# EAGLE design iomk4 (EAGLE 6.5.0)
Lås larm IO-Kort
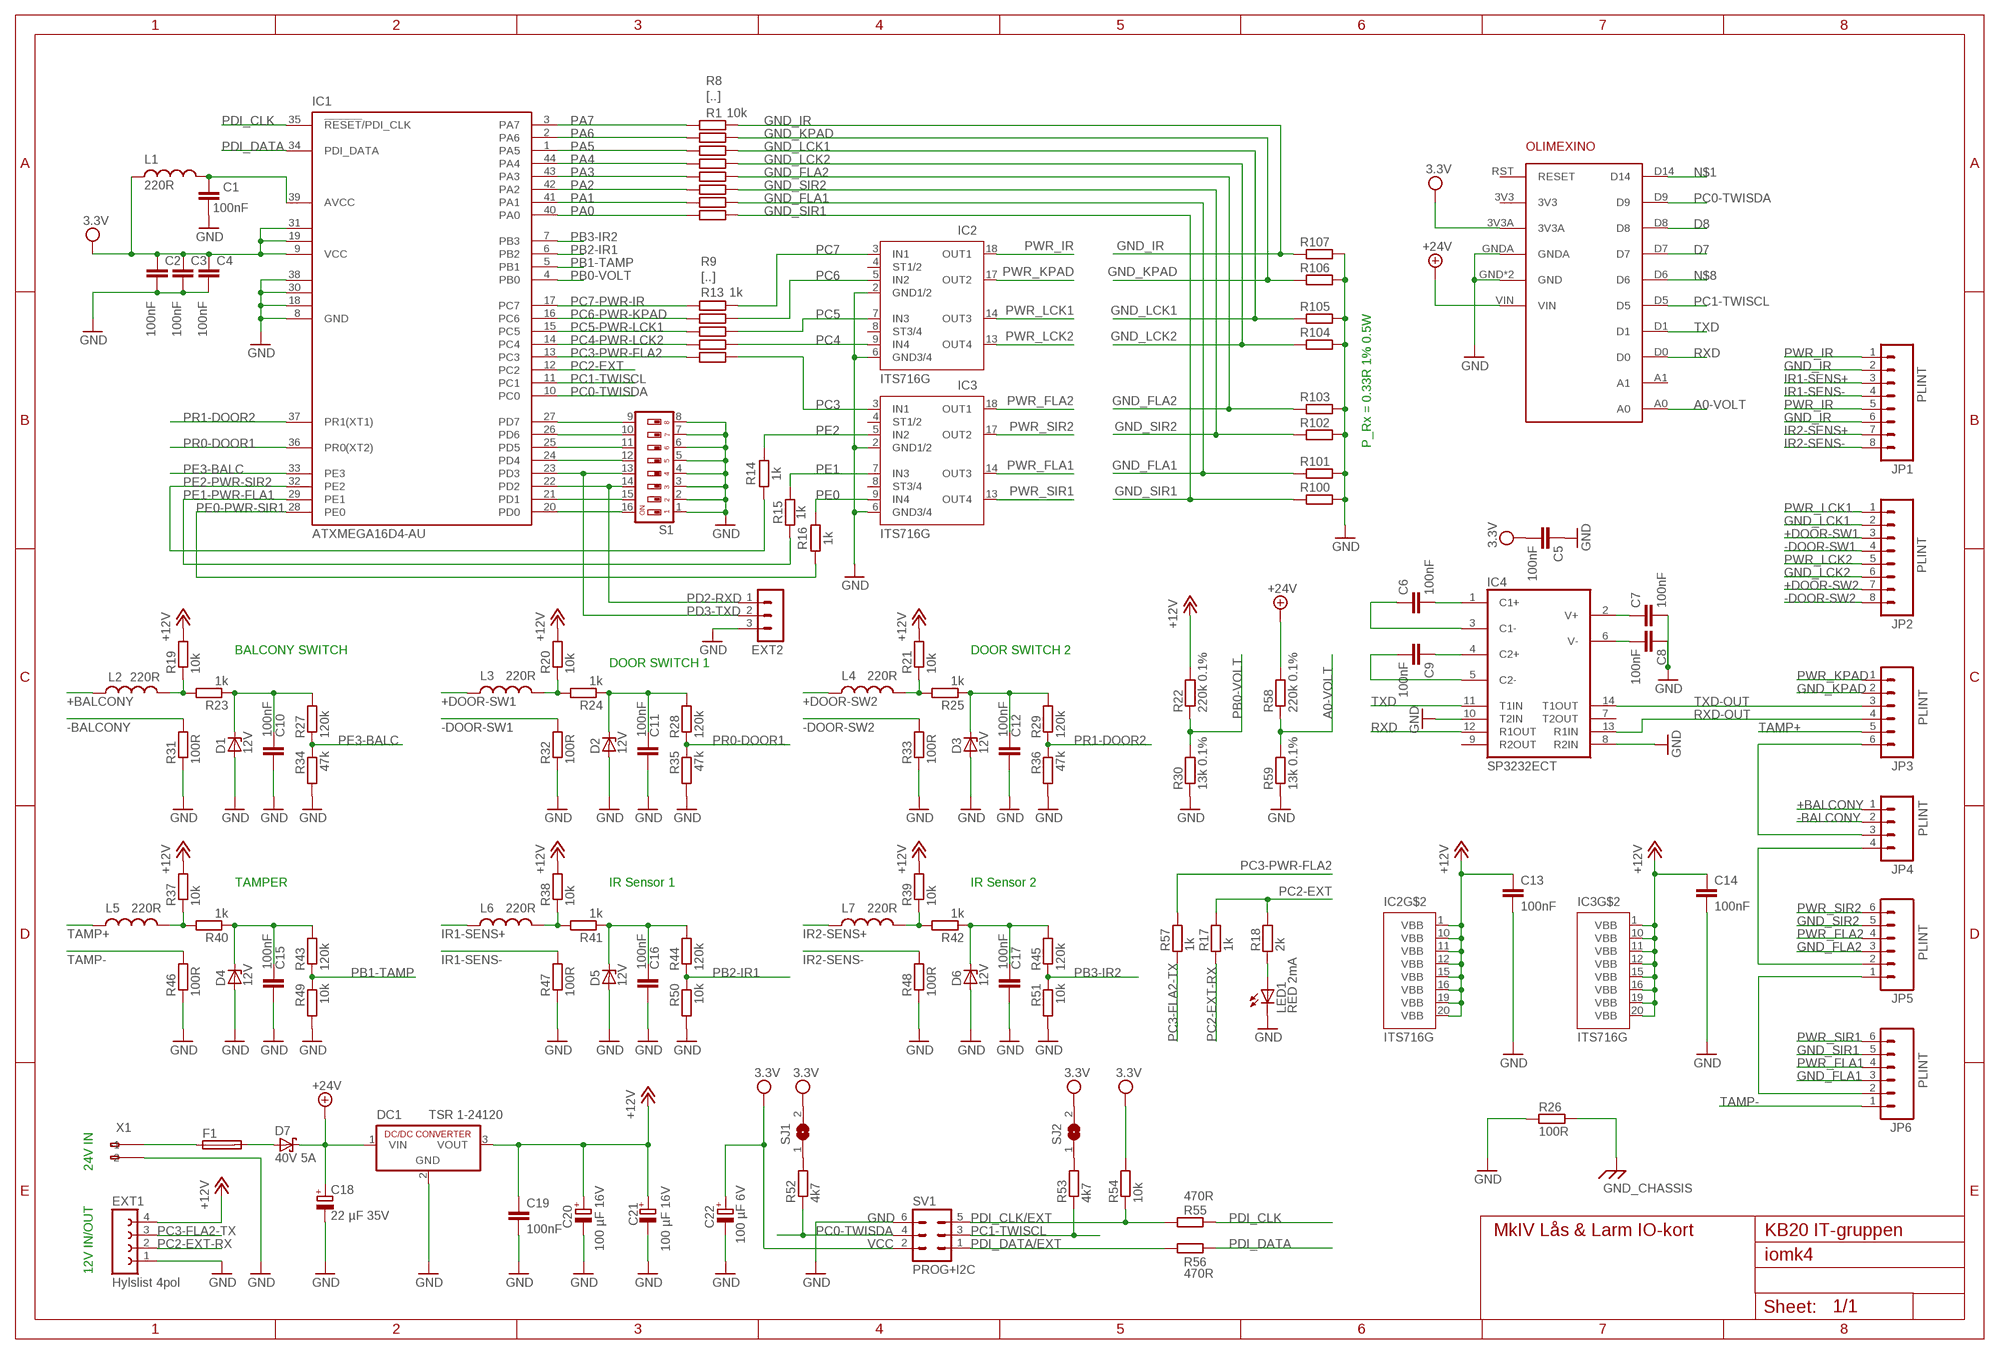
[diagram p0: schematic, sheet 1]

## Parts
C1  100nF  CAPACITOR  [C0805]
C2  100nF  CAPACITOR  [C0805]
C3  100nF  CAPACITOR  [C0805]
C4  100nF  CAPACITOR  [C0805]
C5  100nF  CAPACITOR  [C0805]
C6  100nF  CAPACITOR  [C0805]
C7  100nF  CAPACITOR  [C0805]
C8  100nF  CAPACITOR  [C0805]
C9  100nF  CAPACITOR  [C0805]
C10  100nF  CAPACITOR  [C0805]
C11  100nF  CAPACITOR  [C0805]
C12  100nF  CAPACITOR  [C0805]
C13  100nF  CAPACITOR  [C0805]
C14  100nF  CAPACITOR  [C0805]
C15  100nF  CAPACITOR  [C0805]
C16  100nF  CAPACITOR  [C0805]
C17  100nF  CAPACITOR  [C0805]
C18  22 µF 35V  CPOL-EUD/7343-31R  [D/7343-31R]
C19  100nF  CAPACITOR  [C0805]
C20  100 µF 16V  CPOL-EUD/7343-31R  [D/7343-31R]
C21  100 µF 16V  CPOL-EUD/7343-31R  [D/7343-31R]
C22  100 µF 6V  CPOL-EUCT6032  [CT6032]
D1  12V  ZENER-DIODESOD80C  [SOD80C]
D2  12V  ZENER-DIODESOD80C  [SOD80C]
D3  12V  ZENER-DIODESOD80C  [SOD80C]
D4  12V  ZENER-DIODESOD80C  [SOD80C]
D5  12V  ZENER-DIODESOD80C  [SOD80C]
D6  12V  ZENER-DIODESOD80C  [SOD80C]
D7  40V 5A  SCHOTTKY-DIODESMD  [SMB]
DC1  TSR 1-24120  R-78C12-1.0  [SIP3]
EXT1  Hylslist 4pol  FE04  [FE04]
EXT2  DEBUG PINS  MA03-1-  [MA03]
F1  Fuse Holder  FUSEFTP/60  [FTP/60]
IC1  ATXMEGA16D4-AU  XMEGA16A4A  [TQFP44]
IC2  ITS716G  BTS716G  [PG-DSO-20]
IC3  ITS716G  BTS716G  [PG-DSO-20]
IC4  SP3232ECT  MAX3232CWE  [SO16L]
JP1  PLINT  FK-MPT-8-3.5  [FK-MPT-8-3,5]
JP2  PLINT  FK-MPT-8-3.5  [FK-MPT-8-3,5]
JP3  PLINT  FK-MPT-6-3.5  [FK-MPT-6-3,5]
JP4  PLINT  FK-MPT-4-3.5  [FK-MPT-4-3.5]
JP5  PLINT  FK-MPT-6-3.5  [FK-MPT-6-3,5]
JP6  PLINT  FK-MPT-6-3.5  [FK-MPT-6-3,5]
L1  220R  FERRITE-BEADSL  [L0805]
L2  220R  FERRITE-BEADSL  [L0805]
L3  220R  FERRITE-BEADSL  [L0805]
L4  220R  FERRITE-BEADSL  [L0805]
L5  220R  FERRITE-BEADSL  [L0805]
L6  220R  FERRITE-BEADSL  [L0805]
L7  220R  FERRITE-BEADSL  [L0805]
LED1  RED 2mA  LEDSML0603  [SML0603]
OLIMEXINO-STM1  OLIMEXINO  [OLIMEXINO-STM32]
R1  10k  RESISTORR0805  [R0805]
R2  10k  RESISTORR0805  [R0805]
R3  10k  RESISTORR0805  [R0805]
R4  10k  RESISTORR0805  [R0805]
R5  10k  RESISTORR0805  [R0805]
R6  10k  RESISTORR0805  [R0805]
R7  10k  RESISTORR0805  [R0805]
R8  10k  RESISTORR0805  [R0805]
R9  1k  RESISTORR0805  [R0805]
R10  1k  RESISTORR0805  [R0805]
R11  1k  RESISTORR0805  [R0805]
R12  1k  RESISTORR0805  [R0805]
R13  1k  RESISTORR0805  [R0805]
R14  1k  RESISTORR0805  [R0805]
R15  1k  RESISTORR0805  [R0805]
R16  1k  RESISTORR0805  [R0805]
R17  1k  RESISTORR0805  [R0805]
R18  2k  RESISTORR0805  [R0805]
R19  10k  RESISTORR0805  [R0805]
R20  10k  RESISTORR0805  [R0805]
R21  10k  RESISTORR0805  [R0805]
R22  220k 0.1%  RESISTORR0805  [R0805]
R23  1k  RESISTORR0805  [R0805]
R24  1k  RESISTORR0805  [R0805]
R25  1k  RESISTORR0805  [R0805]
R26  100R  RESISTORR0805  [R0805]
R27  120k  RESISTORR0805  [R0805]
R28  120k  RESISTORR0805  [R0805]
R29  120k  RESISTORR0805  [R0805]
R30  13k 0.1%  RESISTORR0805  [R0805]
R31  100R  RESISTORR0805  [R0805]
R32  100R  RESISTORR0805  [R0805]
R33  100R  RESISTORR0805  [R0805]
R34  47k  RESISTORR0805  [R0805]
R35  47k  RESISTORR0805  [R0805]
R36  47k  RESISTORR0805  [R0805]
R37  10k  RESISTORR0805  [R0805]
R38  10k  RESISTORR0805  [R0805]
R39  10k  RESISTORR0805  [R0805]
R40  1k  RESISTORR0805  [R0805]
R41  1k  RESISTORR0805  [R0805]
R42  1k  RESISTORR0805  [R0805]
R43  120k  RESISTORR0805  [R0805]
R44  120k  RESISTORR0805  [R0805]
R45  120k  RESISTORR0805  [R0805]
R46  100R  RESISTORR0805  [R0805]
R47  100R  RESISTORR0805  [R0805]
R48  100R  RESISTORR0805  [R0805]
R49  10k  RESISTORR0805  [R0805]
R50  10k  RESISTORR0805  [R0805]
R51  10k  RESISTORR0805  [R0805]
R52  4k7  RESISTORR0805  [R0805]
R53  4k7  RESISTORR0805  [R0805]
R54  10k  RESISTORR0805  [R0805]
R55  470R  RESISTORR0805  [R0805]
R56  470R  RESISTORR0805  [R0805]
R57  1k  RESISTORR0805  [R0805]
R58  220k 0.1%  RESISTORR0805  [R0805]
R59  13k 0.1%  RESISTORR0805  [R0805]
R100  0.33R  RESISTORR1210  [R1210]
R101  0.33R  RESISTORR1210  [R1210]
R102  0.33R  RESISTORR1210  [R1210]
R103  0.33R  RESISTORR1210  [R1210]
R104  0.33R  RESISTORR1210  [R1210]
R105  0.33R  RESISTORR1210  [R1210]
R106  0.33R  RESISTORR1210  [R1210]
R107  0.33R  RESISTORR1210  [R1210]
S1  DIP switches  SWS008  [DIL08-SMD-MINI]
SJ1  Solder jumper  SJ  [SJ]
SJ2  Solder jumper  SJ  [SJ]
SV1  PROG+I2C  ML6L  [ML6L]
X1  PLINT  255-402-5  [255-402-5]

## Nets
+12V [12V]: C13.1 C14.1 C19.1 C20.+ C21.+ DC1.3(VOUT) EXT1.4 IC2.1(VBB) IC2.10(VBB) IC2.11(VBB) IC2.12(VBB) IC2.15(VBB) IC2.16(VBB) IC2.19(VBB) IC2.20(VBB) IC3.1(VBB) IC3.10(VBB) IC3.11(VBB) IC3.12(VBB) IC3.15(VBB) IC3.16(VBB) IC3.19(VBB) IC3.20(VBB) R19.2 R20.2 R21.2 R22.2 R37.2 R38.2 R39.2
+24V [24V]: C18.+ D7.C DC1.1(VIN) OLIMEXINO-STM1.VIN R58.2
+BALCONY: JP4.1 L2.1
+DOOR-SW1: JP2.3 L3.1
+DOOR-SW2: JP2.7 L4.1
-BALCONY: JP4.2 R31.2
-DOOR-SW1: JP2.4 R32.2
-DOOR-SW2: JP2.8 R33.2
A0-VOLT: OLIMEXINO-STM1.A0 R58.1 R59.2
D7: OLIMEXINO-STM1.D7
D8: OLIMEXINO-STM1.D8
GND: C1.2 C2.2 C3.2 C4.2 C5.1 C7.2 C8.1 C10.2 C11.2 C12.2 C13.2 C14.2 C15.2 C16.2 C17.2 C18.- C19.2 C20.- C21.- C22.- D1.A D2.A D3.A D4.A D5.A D6.A DC1.2(GND) EXT1.1 EXT2.3 IC1.8(GND) IC1.18(GND1) IC1.30(GND2) IC1.38(GND3) IC2.2(GND1/2) IC2.6(GND3/4) IC3.2(GND1/2) IC3.6(GND3/4) IC4.8(R2IN) IC4.10(T2IN) LED1.C OLIMEXINO-STM1.GND OLIMEXINO-STM1.GND2(GND) OLIMEXINO-STM1.GNDA R26.2 R30.1 R31.1 R32.1 R33.1 R34.2 R35.2 R36.2 R46.1 R47.1 R48.1 R49.2 R50.2 R51.2 R59.1 R100.2 R101.2 R102.2 R103.2 R104.2 R105.2 R106.2 R107.2 S1.1 S1.2 S1.3 S1.4 S1.5 S1.6 S1.7 S1.8 SV1.6 X1.A2(-2)
GND_CHASSIS: R26.1
GND_FLA1: JP6.3 R2.2 R101.1
GND_FLA2: JP5.3 R4.2 R103.1
GND_IR: JP1.2 JP1.6 R8.2 R107.1
GND_KPAD: JP3.2 R7.2 R106.1
GND_LCK1: JP2.2 R6.2 R105.1
GND_LCK2: JP2.6 R5.2 R104.1
GND_SIR1: JP6.5 R1.2 R100.1
GND_SIR2: JP5.5 R3.2 R102.1
IR1-SENS+: JP1.3 L6.1
IR1-SENS-: JP1.4 R47.2
IR2-SENS+: JP1.7 L7.1
IR2-SENS-: JP1.8 R48.2
N$1: OLIMEXINO-STM1.D14
N$2: D7.A F1.2
N$3: C1.1 IC1.39(AVCC) L1.2
N$4: R53.2 SJ2.1
N$8: OLIMEXINO-STM1.D6
N$9: LED1.A R18.2
N$10: L3.2 R20.1 R24.2
N$14: L2.2 R19.1 R23.2
N$15: C10.1 D1.C R23.1 R27.2
N$16: C11.1 D2.C R24.1 R28.2
N$17: L4.2 R21.1 R25.2
N$18 [24V]: F1.1 X1.A1(-1)
N$19: C12.1 D3.C R25.1 R29.2
N$20: R52.2 SJ1.1
N$23: L6.2 R38.1 R41.2
N$25: JP3.6 JP4.3
N$27: JP5.1 JP6.2
N$28: L5.2 R37.1 R40.2
N$29: JP4.4 JP5.2
N$30: C15.1 D4.C R40.1 R43.2
N$31: C16.1 D5.C R41.1 R44.2
N$33: C7.1 IC4.2(V+)
N$34: C8.2 IC4.6(V-)
N$35: L7.2 R39.1 R42.2
N$36: C17.1 D6.C R42.1 R45.2
N$37: C6.2 IC4.1(C1+)
N$38: C9.2 IC4.5(C2-)
N$44: C9.1 IC4.4(C2+)
N$45: C6.1 IC4.3(C1-)
PA0: IC1.40(PA0) R1.1
PA1: IC1.41(PA1) R2.1
PA2: IC1.42(PA2) R3.1
PA3: IC1.43(PA3) R4.1
PA4: IC1.44(PA4) R5.1
PA5: IC1.1(PA5) R6.1
PA6: IC1.2(PA6) R7.1
PA7: IC1.3(PA7) R8.1
PB0-VOLT: IC1.4(PB0) R22.1 R30.2
PB1-TAMP: IC1.5(PB1) R43.1 R49.1
PB2-IR1: IC1.6(PB2) R44.1 R50.1
PB3-IR2: IC1.7(PB3) R45.1 R51.1
PC0-TWISDA: IC1.10(PC0) OLIMEXINO-STM1.D9 R52.1 SV1.4
PC1-TWISCL: IC1.11(PC1) OLIMEXINO-STM1.D5 R53.1 SV1.3
PC2-EXT: IC1.12(PC2) R17.1 R18.1
PC2-EXT-RX: EXT1.2 R17.2
PC3: IC3.3(IN1) R13.1
PC3-FLA2-TX: EXT1.3 R57.1
PC3-PWR-FLA2: IC1.13(PC3) R13.2 R57.2
PC4: IC2.9(IN4) R12.1
PC4-PWR-LCK2: IC1.14(PC4) R12.2
PC5: IC2.7(IN3) R11.1
PC5-PWR-LCK1: IC1.15(PC5) R11.2
PC6: IC2.5(IN2) R10.1
PC6-PWR-KPAD: IC1.16(PC6) R10.2
PC7: IC2.3(IN1) R9.1
PC7-PWR-IR: IC1.17(PC7) R9.2
PD0: IC1.20(PD0) S1.16
PD1: IC1.21(PD1) S1.15
PD2-RXD: EXT2.1 IC1.22(PD2) S1.14
PD3-TXD: EXT2.2 IC1.23(PD3) S1.13
PD4: IC1.24(PD4) S1.12
PD5: IC1.25(PD5) S1.11
PD6: IC1.26(PD6) S1.10
PD7: IC1.27(PD7) S1.9
PDI_CLK: IC1.35(!RESET!/PDI_CLK) R55.1
PDI_CLK/EXT: R54.1 R55.2 SV1.5
PDI_DATA: IC1.34(PDI_DATA) R56.1
PDI_DATA/EXT: R56.2 SV1.1
PE0: IC3.9(IN4) R16.1
PE0-PWR-SIR1: IC1.28(PE0) R16.2
PE1: IC3.7(IN3) R15.1
PE1-PWR-FLA1: IC1.29(PE1) R15.2
PE2: IC3.5(IN2) R14.1
PE2-PWR-SIR2: IC1.32(PE2) R14.2
PE3-BALC: IC1.33(PE3) R27.1 R34.1
PR0-DOOR1: IC1.36(PR0(XT2)) R28.1 R35.1
PR1-DOOR2: IC1.37(PR1(XT1)) R29.1 R36.1
PWR_FLA1 [12V]: IC3.14(OUT3) JP6.4
PWR_FLA2 [12V]: IC3.18(OUT1) JP5.4
PWR_IR [12V]: IC2.18(OUT1) JP1.1 JP1.5
PWR_KPAD [12V]: IC2.17(OUT2) JP3.1
PWR_LCK1 [12V]: IC2.14(OUT3) JP2.1
PWR_LCK2 [12V]: IC2.13(OUT4) JP2.5
PWR_SIR1 [12V]: IC3.13(OUT4) JP6.6
PWR_SIR2 [12V]: IC3.17(OUT2) JP5.6
RXD: IC4.12(R1OUT) OLIMEXINO-STM1.D0
RXD-OUT: IC4.13(R1IN) JP3.4
TAMP+: JP3.5 L5.1
TAMP-: JP6.1 R46.2
TXD: IC4.11(T1IN) OLIMEXINO-STM1.D1
TXD-OUT: IC4.14(T1OUT) JP3.3
VCC: C2.1 C3.1 C4.1 C5.2 C22.+ IC1.9(VCC) IC1.19(VCC1) IC1.31(VCC2) L1.1 OLIMEXINO-STM1.3V3A R54.2 SJ1.2 SJ2.2 SV1.2 ; supply symbol labelled 3.3V
Unconnected: IC2.4(ST1/2) IC2.8(ST3/4) IC3.4(ST1/2) IC3.8(ST3/4) IC4.7(T2OUT) IC4.9(R2OUT) OLIMEXINO-STM1.3V3 OLIMEXINO-STM1.A1 OLIMEXINO-STM1.RST(RESET) X1.B1(B-1) X1.B2(B-2)

## Notes on the sheet
- [..]
- [..]
- P_Rx = 0.33R 1% 0.5W
- BALCONY SWITCH | DOOR SWITCH 2
- DOOR SWITCH 1
- TAMPER | IR Sensor 1 | IR Sensor 2
- 24V IN
- MkIV Lås & Larm IO-kort | KB20 IT-gruppen
- 12V IN/OUT

## Power pins joined to a net without a drawn wire
GND: IC4.15(GND)
VCC: IC4.16(VCC)

## Library data of the parts
C1-C17 C19 = kb20:CAPACITOR; ELFA: 65-724-19
C18 = rcl:CPOL-EU: POLARIZED CAPACITOR, European symbol; ELFA: 67-703-90
C20 C21 = rcl:CPOL-EU: POLARIZED CAPACITOR, European symbol; ELFA: 67-730-89
C22 = rcl:CPOL-EU: POLARIZED CAPACITOR, European symbol; ELFA: 67-712-39
D1-D6 = diode:ZENER-DIODE: Z-Diode; ELFA: 70-093-17
D7 = diode:SCHOTTKY-DIODE: Schottky Diode; ELFA: 70-087-10
DC1 = dc-dc-converter:R-78C*-1.0: INNOLINE DC/DC-Converter 1.0 AMP SIP3 Single Output Source: Data sheet <http://www.mikrocontroller.net/attachment/150645/157764-da-01-en-DC_DC_WANDLER_R_78C5_0_1_0.pdf>; ELFA: 69-534-87
EXT1 = kb20:FE04: FEMALE HEADER; ELFA: 43-782-79
EXT2 = kb20:MA03-1: Pin header; INFO: Monteras ej
F1 = kb20:FUSE; ELFA: 33-152-80
IC1 = atmel:XMEGA16A4: MICROCONTROLLER Features High-performance, Low-power 8/16-bit AVR XMEGA Microcontroller Non-Volatile Program and Data Memories - 16 KB - 128 KB of In-System Self-Programmable Flash - 4 KB - 8 KB Boot Code Section with Independent Lock Bits - 1 KB - 2 KB EEPROM - 2 KB - 8 KB Internal SRAM Peripheral Features - Four-channel DMA Controller with support for external requests - Eight-channel Event System - Five 16-bit Timer/Counters Three Timer/Counters with 4 Output Compare or Input Capture channels Two Timer/Counters with 2 Output Compare or Input Capture channels High-Resolution Extensions on all Timer/Counters Advanced Waveform Extension on one Timer/Counter - Five USARTs IrDA Extension on one USART - Two Two-Wire Interfaces with dual address match (I2C and SMBus compatible) - Two SPIs (Serial Peripheral Interfaces) peripherals - AES and DES Crypto Engine - 16-bit Real Time Counter with Separate Oscillator - One Twelve-channel, 12-bit, 2 Msps Analog to Digital Converter - One Two-channel, 12-bit, 1 Msps Digital to Analog Converter - Two Analog Comparators with Window compare function - External Interrupts on all General Purpose I/O pins - Programmable Watchdog Timer with Separate On-chip Ultra Low Power Oscillator Special Microcontroller Features - Power-on Reset and Programmable Brown-out Detection - Internal and External Clock Options with PLL - Programmable Multi-level Interrupt Controller - Sleep Modes: Idle, Power-down, Standby, Power-save, Extended Standby - Advanced Programming, Test and Debugging Interfaces PDI (Program and Debug Interface) for programming, test and debugging I/O and Packages - 34 Programmable I/O Lines - 44 - lead TQFP - 44 - pad VQFN/QFN - 49 - ball VFBGA Operating Voltage - 1.6 - 3.6V Speed performance - 0 - 12 MHz @ 1.6 - 3.6V - 0 - 32 MHz @ 2.7 - 3.6V Drawn by Dipl.-Ing. (FH) Robert Siegler Created: 27.05.09; ELFA: 73-287-55; MF: ATMEL; MPN: ATXMEGA16A4-AU; OC_FARNELL: 1748552; OC_NEWARK: unknown
IC2 IC3 = infineon:BTS716G: Smart High-Side Power Switch Four Channels: 4 x 140mOhm staus Feedback Source: http://www.infineon.com/dgdl/BTS716G.pdf; ELFA: 71-017-02; OC_FARNELL: unknown; OC_NEWARK: unknown
IC4 = maxim:MAX3232*: True RS-232 Transceivers 3.0V to 5.5V, Low-Power up to 1Mbps, Using Four 0.1µF External Capacitors Source: http://pdfserv.maxim-ic.com/en/ds/MAX3222-MAX3241.pdf; ELFA: 73-221-10; MF: MAXIM INTEGRATED PRODUCTS; MPN: MAX3232CSE+; OC_FARNELL: 9725504; OC_NEWARK: 68K4630
JP1 JP2 = kb20:FK-MPT-8-3.5: PCB terminal block; ELFA: 48-335-35
JP3 JP5 JP6 = kb20:FK-MPT-6-3.5: PCB terminal block; ELFA: 48-335-34
JP4 = kb20:FK-MPT-4-3.5: PCB terminal block; ELFA: 48-335-32
L1-L7 = kb20:FERRITE-BEADS; ELFA: 65-500-16
LED1 = led:LED: LED OSRAM: - CHIPLED LG R971, LG N971, LY N971, LG Q971, LY Q971, LO R971, LY R971 LH N974, LH R974 LS Q976, LO Q976, LY Q976 LO Q996 - Hyper CHIPLED LW Q18S LB Q993, LB Q99A, LB R99A - SideLED LS A670, LO A670, LY A670, LG A670, LP A670 LB A673, LV A673, LT A673, LW A673 LH A674 LY A675 LS A676, LA A676, LO A676, LY A676, LW A676 LS A679, LY A679, LG A679 - Hyper Micro SIDELED® LS Y876, LA Y876, LO Y876, LY Y876 LT Y87S - SmartLED LW L88C, LW L88S LB L89C, LB L89S, LG L890 LS L89K, LO L89K, LY L89K LS L896, LA L896, LO L896, LY L896 - TOPLED LS T670, LO T670, LY T670, LG T670, LP T670 LSG T670, LSP T670, LSY T670, LOP T670, LYG T670 LG T671, LOG T671, LSG T671 LB T673, LV T673, LT T673, LW T673 LH T674 LS T676, LA T676, LO T676, LY T676, LB T676, LH T676, LSB T676, LW T676 LB T67C, LV T67C, LT T67C, LS T67K, LO T67K, LY T67K, LW E67C LS E67B, LA E67B, LO E67B, LY E67B, LB E67C, LV E67C, LT E67C LW T67C LS T679, LY T679, LG T679 LS T770, LO T770, LY T770, LG T770, LP T770 LB T773, LV T773, LT T773, LW T773 LH T774 LS E675, LA E675, LY E675, LS T675 LS T776, LA T776, LO T776, LY T776, LB T776 LHGB T686 LT T68C, LB T68C - Hyper Mini TOPLED® LB M676 - Mini TOPLED Santana® LG M470 LS M47K, LO M47K, LY M47K Source: http://www.osram.convergy.de LUXEON: - LUMILED® LXK2-PW12-R00, LXK2-PW12-S00, LXK2-PW14-U00, LXK2-PW14-V00 LXK2-PM12-R00, LXK2-PM12-S00, LXK2-PM14-U00 LXK2-PE12-Q00, LXK2-PE12-R00, LXK2-PE12-S00, LXK2-PE14-T00, LXK2-PE14-U00 LXK2-PB12-K00, LXK2-PB12-L00, LXK2-PB12-M00, LXK2-PB14-N00, LXK2-PB14-P00, LXK2-PB14-Q00 LXK2-PR12-L00, LXK2-PR12-M00, LXK2-PR14-Q00, LXK2-PR14-R00 LXK2-PD12-Q00, LXK2-PD12-R00, LXK2-PD12-S00 LXK2-PH12-R00, LXK2-PH12-S00 LXK2-PL12-P00, LXK2-PL12-Q00, LXK2-PL12-R00 Source: www.luxeon.com KINGBRIGHT: KA-3528ASYC Source: www.kingbright.com; ELFA: 75-102-85
OLIMEXINO-STM1 = kb20:OLIMEXINO
R1-R8 R19-R21 R37-R39 R49-R51 R54 = kb20:RESISTOR; ELFA: 60-587-42
R9-R17 R23-R25 R40-R42 R57 = kb20:RESISTOR; ELFA: 60-587-18
R18 = kb20:RESISTOR; ELFA: 60-587-25
R22 R58 = kb20:RESISTOR; ELFA: 60-220-26
R26 R31-R33 R46-R48 = kb20:RESISTOR; ELFA: 60-586-94
R27-R29 R43-R45 = kb20:RESISTOR; ELFA: 60-587-68
R30 R59 = kb20:RESISTOR; ELFA: 60-219-94
R34-R36 = kb20:RESISTOR; ELFA: 60-587-58
R52 R53 = kb20:RESISTOR; ELFA: 60-587-34
R55 R56 = kb20:RESISTOR; ELFA: 60-587-10
R100-R107 = kb20:RESISTOR; ELFA: 60-333-95
S1 = kb20:SWS008; ELFA: 35-398-85
SJ1 SJ2 = jumper:SJ: SMD solder JUMPER
SV1 = con-harting-ml:ML6: HARTING; ELFA: 43-653-83; INFO: IDC kontakt 6 polig Vinklad; OC_FARNELL: unknown; OC_NEWARK: unknown
X1 = con-wago255:255-402-5: WAGO; ELFA: 48-410-30; OC_FARNELL: unknown; OC_NEWARK: unknown

## Net classes
0 default: width 0.254 mm, drill 0.483 mm, clearance 0.178 mm
1 24V: width 0.254 mm, drill 0.483 mm, clearance 0.178 mm
2 12V: width 0.254 mm, drill 0.483 mm, clearance 0.178 mm
3 12V GND: width 0.254 mm, drill 0.483 mm, clearance 0.178 mm
4 Text: width 0.051 mm, drill 0.051 mm, clearance 0.051 mm

## Board
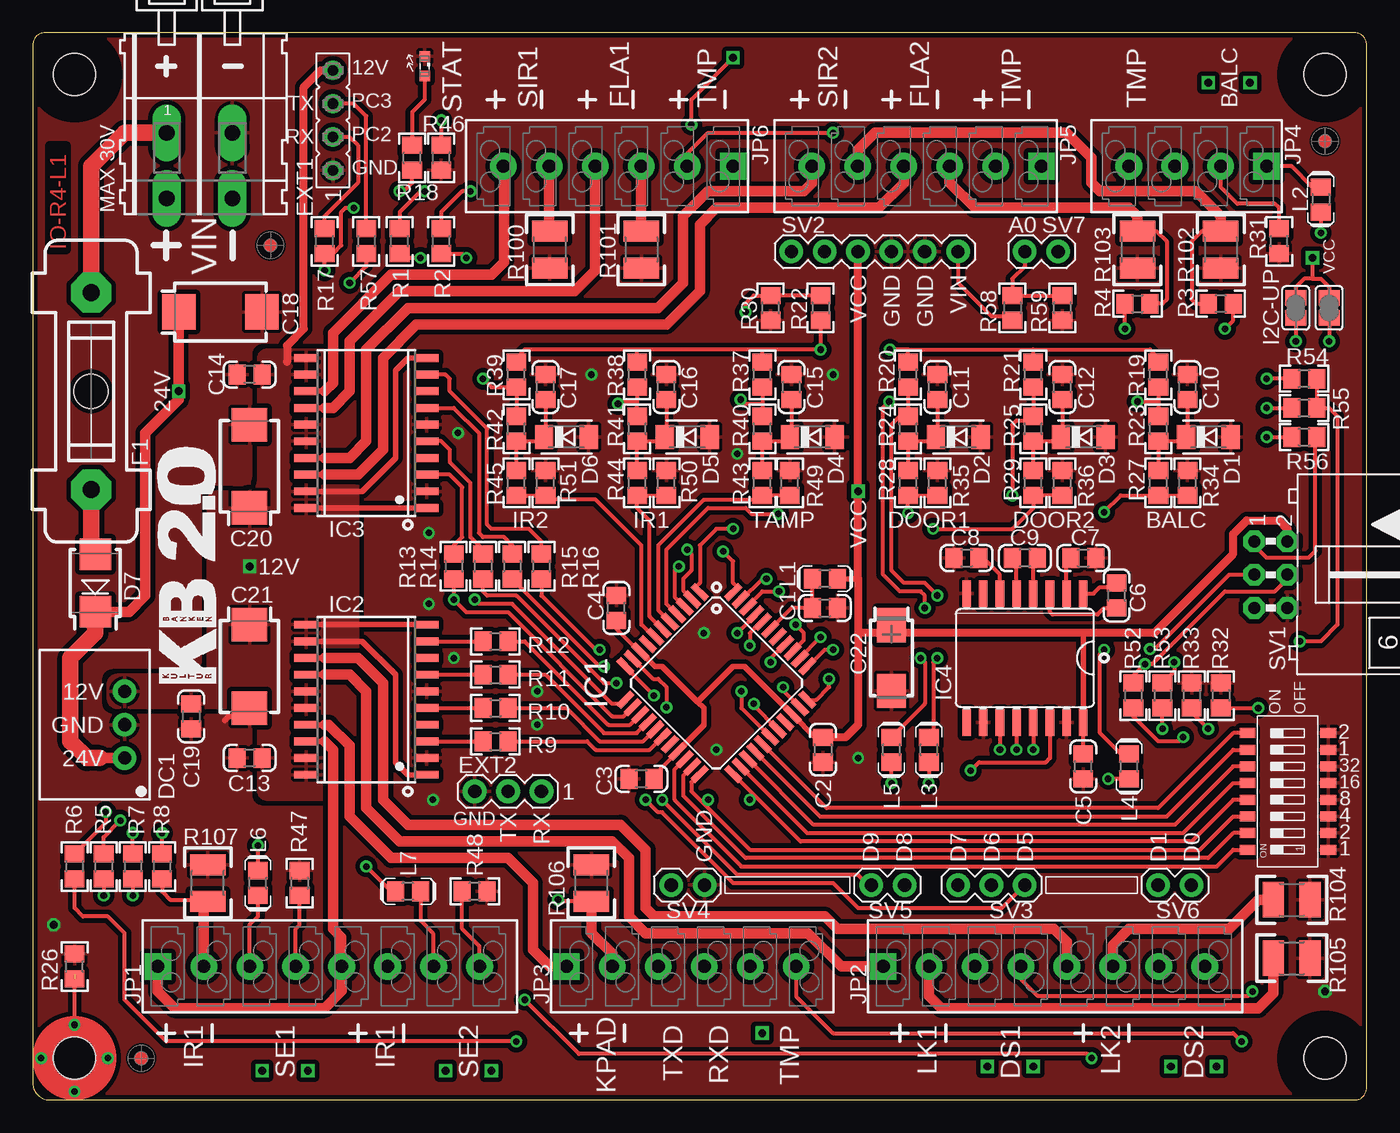
[diagram p1: board, top side]
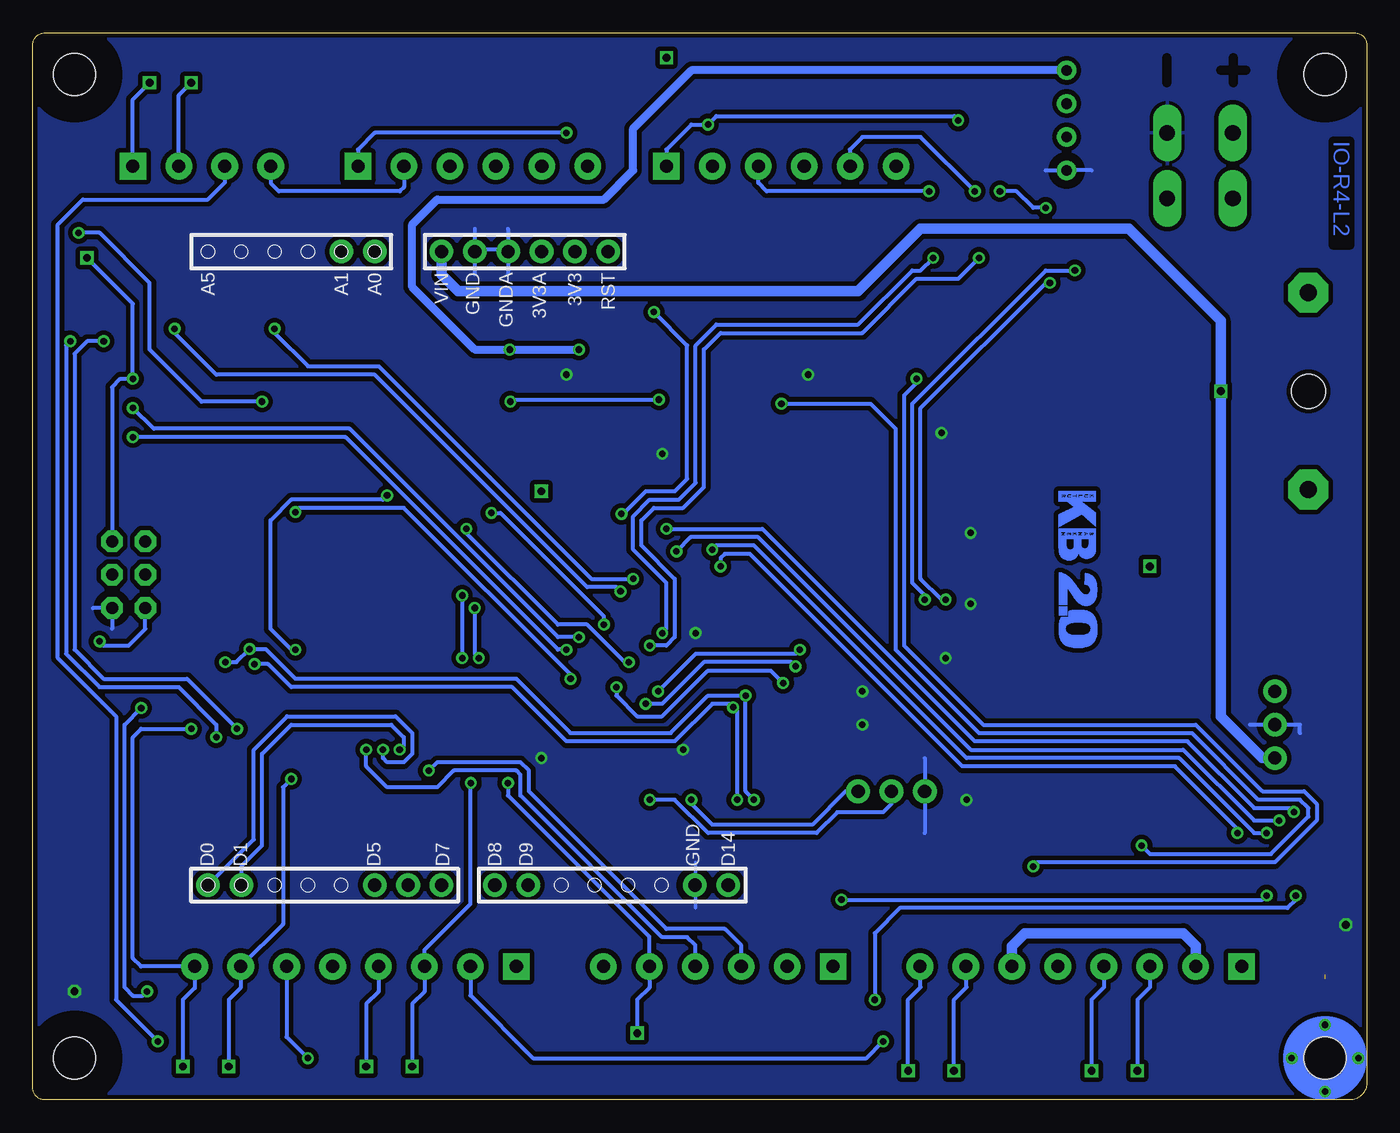
[diagram p2: board, bottom side, seen from below]

Size 101.6 x 81.28 mm. Coordinates in mm from the lower left corner, seen from the top.
Outline: 0,80.38 0,1.27 arc90 1.27,0 100.7,0 arc90 101.6,0.9 101.6,80.38 arc90 100.7,81.28 0.9,81.28 arc90 0,80.38
Copper layers (1*16): Top 0.035mm / dielectric 1.5mm / Bottom 0.035mm
Design rules "Cogra *": minimum track width 0.25mm, minimum drill 0.5mm, track to track 0.29mm, track to pad 0.29mm, pad to pad 0.29mm, via to via 0.29mm, smd to smd 0.25mm, copper to edge 5mil, drill to drill 8mil, minimum pad ring 10mil, minimum via ring 8mil, stop-mask expansion 4mil, vias tented up to drill 0.5mm, thermal gap 0.25mm
Holes 3.2 mm at 3.17,3.17 3.17,78.11 98.42,78.11 98.42,3.17
tRestrict: area -0.1,74.9 to 6.4,81.4; area 95.2,-0.1 to 101.7,6.4; area 95.2,74.9 to 101.7,81.4
bRestrict: area -0.1,74.9 to 6.4,81.4; area 95.2,74.9 to 101.7,81.4; area 95.2,-0.1 to 101.7,6.4; area 6,27.6 to 8,29.6; area 94.5,36.4 to 96.6,38.5; area 64.4,63.6 to 66.4,65.7; area 66.9,63.6 to 69,65.7; area 21.8,69.8 to 23.9,71.8; area 32.6,22.5 to 34.7,24.5; area 50.2,15.3 to 52.2,17.4; 3 lines

### Footprints (pad centres in the part's own frame; a part is rotated, then mirrored left to right if it is on the bottom)
C0805 = smd 1.3 x 1.5: 1 -0.95,0; 2 0.95,0
D/7343-31R = smd 2.55 x 2.7: + 3.175,0; - -3.175,0
CT6032 = smd 2.6 x 2.2: + -2.5,0; - 2.5,0
SOD80C = smd 1.4 x 1.8: A 1.7,0; C -1.7,0
SMB = smd 2.4 x 2.4: A 2.2,0; C -2.2,0
SIP3 = drill 1 pad 1.676: 1 -2.54,0; 2 0,0; 3 2.54,0
FE04 = drill 0.813: 1 -3.81,0; 2 -1.27,0; 3 1.27,0; 4 3.81,0
MA03 = drill 1.016: 1 -2.54,0; 2 0,0; 3 2.54,0
FTP/60 = drill 1.3 pad 3.048 octagon: 1 -7.5,0; 2 7.5,0 | hole 2.6: 0,0
TQFP44 = smd 1.5 x 0.5: 1 -5.8,4; 2 -5.8,3.2; 3 -5.8,2.4; 4 -5.8,1.6; 5 -5.8,0.8; 6 -5.8,0; 7 -5.8,-0.8; 8 -5.8,-1.6; 9 -5.8,-2.4; 10 -5.8,-3.2; 11 -5.8,-4; 23 5.8,-4; 24 5.8,-3.2; 25 5.8,-2.4; 26 5.8,-1.6; 27 5.8,-0.8; 28 5.8,0; 29 5.8,0.8; 30 5.8,1.6; 31 5.8,2.4; 32 5.8,3.2; 33 5.8,4 | smd 0.5 x 1.5: 12 -4,-5.8; 13 -3.2,-5.8; 14 -2.4,-5.8; 15 -1.6,-5.8; 16 -0.8,-5.8; 17 0,-5.8; 18 0.8,-5.8; 19 1.6,-5.8; 20 2.4,-5.8; 21 3.2,-5.8; 22 4,-5.8; 34 4,5.8; 35 3.2,5.8; 36 2.4,5.8; 37 1.6,5.8; 38 0.8,5.8; 39 0,5.8; 40 -0.8,5.8; 41 -1.6,5.8; 42 -2.4,5.8; 43 -3.2,5.8; 44 -4,5.8
PG-DSO-20 = smd 0.6 x 1.8: 1 -5.715,-4.6; 2 -4.445,-4.6; 3 -3.175,-4.6; 4 -1.905,-4.6; 5 -0.635,-4.6; 6 0.635,-4.6; 7 1.905,-4.6; 8 3.175,-4.6; 9 4.445,-4.6; 10 5.715,-4.6; 11 5.715,4.6; 12 4.445,4.6; 13 3.175,4.6; 14 1.905,4.6; 15 0.635,4.6; 16 -0.635,4.6; 17 -1.905,4.6; 18 -3.175,4.6; 19 -4.445,4.6; 20 -5.715,4.6
SO16L = smd 0.66 x 2.032: 1 -4.445,-4.902; 2 -3.175,-4.902; 3 -1.905,-4.902; 4 -0.635,-4.902; 5 0.635,-4.902; 6 1.905,-4.902; 7 3.175,-4.902; 8 4.445,-4.902; 9 4.445,4.902; 10 3.175,4.902; 11 1.905,4.902; 12 0.635,4.902; 13 -0.635,4.902; 14 -1.905,4.902; 15 -3.175,4.902; 16 -4.445,4.902
FK-MPT-8-3,5 = drill 1 pad 2.032 square: 1 0,0 | drill 1 pad 2.032: 2 3.5,0; 3 7,0; 4 10.5,0; 5 14,0; 6 17.5,0; 7 21,0; 8 24.5,0
FK-MPT-6-3,5 = drill 1 pad 2.032 square: 1 0,0 | drill 1 pad 2.032: 2 3.5,0; 3 7,0; 4 10.5,0; 5 14,0; 6 17.5,0
FK-MPT-4-3.5 = drill 1 pad 2.032 square: 1 0,0 | drill 1 pad 2.032: 2 3.5,0; 3 7,0; 4 10.5,0
L0805 = smd 1.3 x 1.5: 1 -0.95,0; 2 0.95,0
SML0603 = smd 0.8 x 0.8: A 0.75,0; C -0.75,0
OLIMEXINO-STM32 = drill 1: 3V3 1.575,-23.978; 3V3A 4.115,-23.978; A0 16.815,-23.978; A1 19.355,-23.978; D0 29.515,24.282; D1 26.975,24.282; D5 16.815,24.282; D6 14.275,24.282; D7 11.735,24.282; D8 7.671,24.282; D9 5.131,24.282; D14 -10.109,24.282; GND 9.195,-23.978; GND2 -7.569,24.282; GNDA 6.655,-23.978; RST -0.965,-23.978; VIN 11.735,-23.978
R0805 = smd 1.3 x 1.5: 1 -0.95,0; 2 0.95,0
R1210 = smd 1.6 x 2.7: 1 -1.4,0; 2 1.4,0
DIL08-SMD-MINI = smd 0.76 x 1.2: 1 -4.445,-3.102; 2 -3.175,-3.102; 3 -1.905,-3.102; 4 -0.635,-3.102; 5 0.635,-3.102; 6 1.905,-3.102; 7 3.175,-3.102; 8 4.445,-3.102; 9 4.445,3.048; 10 3.175,3.048; 11 1.905,3.048; 12 0.635,3.048; 13 -0.635,3.048; 14 -1.905,3.048; 15 -3.175,3.048; 16 -4.445,3.048
SJ = smd 1.168 x 1.6: 1 -0.762,0; 2 0.762,0
ML6L = drill 0.914 octagon: 1 -2.54,-1.27; 2 -2.54,1.27; 3 0,-1.27; 4 0,1.27; 5 2.54,-1.27; 6 2.54,1.27
255-402-5 = drill 1.2 long: A1 -2.5,0; A2 2.5,0; B1 -2.5,-5; B2 2.5,-5

### Placement (x,y rotation side)
C1  60.33,37.47 0 top
C2  60.19,26.67 270 top
C3  46.35,24.45 180 top
C4  44.45,37.47 90 top
C5  80.01,25.4 90 top
C6  82.55,38.42 90 top
C7  80.01,41.27 0 top
C8  71.12,41.27 0 top
C9  75.56,41.27 180 top
C10  87.95,54.29 90 top
C11  68.9,54.29 90 top
C12  78.42,54.29 90 top
C13  16.51,26.04 180 top
C14  16.51,55.24 180 top
C15  57.78,54.29 90 top
C16  48.26,54.29 90 top
C17  39.05,54.29 90 top
C18  14.29,60.01 180 top
C19  12.06,29.21 270 top
C20  16.51,48.26 270 top
C21  16.51,33.02 90 top
C22  65.41,33.66 270 top
D1  89.53,50.48 0 top
D2  70.48,50.48 0 top
D3  80.01,50.48 0 top
D4  59.37,50.48 0 top
D5  49.85,50.48 0 top
D6  40.64,50.48 0 top
D7  4.76,39.37 90 top
DC1  6.99,28.57 90 top
EXT1  22.86,74.61 90 top
EXT2  36.2,23.5 180 top
F1  4.45,53.98 270 top
IC1  52.07,31.75 315 top
IC2  25.4,30.48 90 top
IC3  25.4,50.8 90 top
IC4  75.56,33.66 180 top
JP1  9.53,10.16 0 top
JP2  64.77,10.16 0 top
JP3  40.64,10.16 0 top
JP4  93.98,71.12 180 top
JP5  76.83,71.12 180 top
JP6  53.34,71.12 180 top
L1  60.33,39.69 180 top
L2  98.11,68.58 270 top
L3  68.26,26.67 90 top
L4  83.5,25.4 90 top
L5  65.41,26.67 90 top
L6  17.14,16.51 90 top
L7  28.57,15.88 180 top
LED1  29.84,78.74 270 top
OLIMEXINO-STM1  58.74,40.64 180 bottom
R1  27.94,65.41 90 top
R2  31.11,65.41 90 top
R3  90.49,60.64 180 top
R4  84.14,60.64 0 top
R5  5.4,17.78 270 top
R6  3.17,17.78 270 top
R7  7.62,17.78 270 top
R8  9.84,17.78 270 top
R9  35.24,27.3 0 top
R10  35.24,29.84 0 top
R11  35.24,32.38 0 top
R12  35.24,34.92 0 top
R13  32.07,40.64 270 top
R14  34.29,40.64 270 top
R15  36.51,40.64 270 top
R16  38.73,40.64 270 top
R17  22.23,65.41 90 top
R18  28.89,71.75 90 top
R19  85.72,55.24 90 top
R20  66.67,55.24 90 top
R21  76.2,55.24 90 top
R22  60.01,60.33 270 top
R23  85.72,51.12 90 top
R24  66.67,51.12 90 top
R25  76.2,51.12 90 top
R26  3.17,10.16 90 top
R27  85.72,46.99 90 top
R28  66.67,46.99 90 top
R29  76.2,46.99 90 top
R30  56.2,60.33 90 top
R31  94.93,65.41 90 top
R32  90.49,30.8 270 top
R33  88.27,30.8 270 top
R34  87.95,46.99 90 top
R35  68.9,46.99 90 top
R36  78.42,46.99 90 top
R37  55.56,55.24 90 top
R38  46.04,55.24 90 top
R39  36.83,55.24 90 top
R40  55.56,51.12 90 top
R41  46.04,51.12 90 top
R42  36.83,51.12 90 top
R43  55.56,46.99 90 top
R44  46.04,46.99 90 top
R45  36.83,46.99 90 top
R46  31.11,71.75 90 top
R47  20.32,16.51 270 top
R48  33.66,15.88 180 top
R49  57.66,46.99 90 top
R50  48.26,46.99 90 top
R51  39.05,46.99 90 top
R52  83.82,30.8 270 top
R53  86.04,30.8 270 top
R54  96.84,54.93 180 top
R55  96.84,52.7 0 top
R56  96.84,50.48 0 top
R57  25.4,65.41 270 top
R58  74.61,60.33 270 top
R59  78.42,60.33 90 top
R100  39.37,64.77 270 top
R101  46.35,64.77 270 top
R102  90.49,64.77 270 top
R103  84.14,64.77 270 top
R104  95.89,15.24 0 top
R105  95.89,10.79 0 top
R106  42.55,16.51 90 top
R107  13.34,16.51 90 top
S1  95.57,23.5 90 top
SJ1  98.74,60.33 90 top
SJ2  96.2,60.33 90 top
SV1  94.3,40.01 270 top
U$1  [FIDUCIAL_G10]  98.42,73.03 0 top
U$2  [FIDUCIAL_G10]  8.26,3.17 0 top
U$3  [FIDUCIAL_G10]  18.1,65.09 0 top
U$5  [KB-LOGG-18MM]  13.97,31.75 90 top
U$7  [KB-LOGGA-12MM-B]  23.5,46.35 270 bottom
X1  12.7,73.66 0 top

### Tracks (layer width: path | path; a pad name or v marks a point on that pad's centre or on a via)
+12V  (via drill 0.5, 0.6)
  Top 0.305: 66.67,57.15 76.2,57.15 | 76.2,57.15 85.09,57.15 85.72,56.52 R19.2 | R20.2 66.67,57.15 | 66.67,57.15 v65.28,57.15 | R22.2 v60.01,57.15 55.56,57.15 | 55.56,57.15 46.04,57.15 | 46.04,57.15 37.47,57.15 36.83,56.52 R39.2 | R38.2 46.04,57.15 | R37.2 55.56,57.15 | R21.2 76.2,57.15
  Top 0.406: IC3.1 IC3.20 | IC3.10 28.57,56.52 27.62,55.56 27.62,48.9 25.08,46.35 IC3.19 | IC2.1 28.57,24.77 27.62,25.72 27.62,32.38 25.08,34.92 IC2.12 | IC2.10 IC2.11
  Top 0.61: 19.37,56.2 19.37,57.47 20.64,58.74 20.64,77.15 21.91,78.42 EXT1.4
  Bottom 0.61: v60.01,57.15 v65.28,57.15 67.94,57.15 72.71,61.91 72.71,66.67 70.8,68.58 58.1,68.58 55.88,70.8 55.88,73.98 51.44,78.42 EXT1.4
  other vias: 16.51,40.64
  pour Top (isolate 0.356): 13.34,45.6 13.34,33.13 arc-90 12.59,32.38 6.46,32.38 arc90 5.71,31.64 5.71,30.59 arc90 6.46,29.84 16.39,29.84 arc-90 17.14,29.09 17.14,23.61 arc90 17.89,22.86 24.02,22.86 arc90 24.77,23.61 24.77,56.4 arc90 24.02,57.15 17.89,57.15 arc90 17.14,56.4 17.14,47.1 arc-90 16.39,46.35 14.09,46.35 arc90
+24V  (via drill 0.6)
  Top 0.305: 4.74,37.15 D7.C | OLIMEXINO-STM1.VIN 70.48,64.61 70.48,62.23 73.03,59.69 74.3,59.69 R58.2
  Top 0.813: DC1.1 5.08,26.04 | D7.C 7.33,37.17 8.57,38.42 8.57,50.8 11.11,53.34 v11.11,53.98 C18.+
  Top 1.27: 5.08,26.04 4.13,26.04 2.86,27.3 2.86,33.66 4.76,35.56 D7.C
  Bottom 0.813: OLIMEXINO-STM1.VIN 70.47,62.85 69.22,61.59 38.73,61.59 33.97,66.36 18.1,66.36 11.11,59.37 11.11,29.21 7.94,26.04 DC1.1
+BALCONY  (via drill 0.6)
  Top 0.305: L2.1 97.47,69.53 95.89,71.12 JP4.1
  Bottom 0.305: JP4.1 93.98,76.2 v92.71,77.47
+DOOR-SW1  (via drill 0.5, 0.6)
  Top 0.305: L3.1 68.26,24.16 v68.24,24.13
  Bottom 0.305: v68.24,24.13 68.26,24.11 68.26,14.92 71.77,11.41 JP2.3 71.77,8.24 72.71,7.3 v72.71,2.54
+DOOR-SW2  (via drill 0.5, 0.6)
  Top 0.305: L4.1 v81.92,24.45
  Bottom 0.305: v81.92,24.45 82.55,23.81 82.55,13.38 JP2.7 85.77,8.53 86.68,7.62 v86.68,2.54
-BALCONY  (via drill 0.6)
  Top 0.305: R31.2 94.93,67.94 94.61,68.26 91.76,68.26 90.49,69.53 JP4.2
  Bottom 0.305: JP4.2 90.48,76.53 v89.53,77.47
-DOOR-SW1  (via drill 0.5, 0.6)
  Top 0.305: JP2.4 75.27,9.19 76.52,7.94 92.58,7.94 v92.9,8.26 | v93.34,29.84 R32.2
  Bottom 0.305: v93.34,29.84 94.61,28.57 94.61,8.57 93.98,7.94 93.22,7.94 v92.9,8.26 | JP2.4 75.27,8.23 76.2,7.3 v76.2,2.54
-DOOR-SW2  (via drill 0.5, 0.6)
  Top 0.305: R33.2 88.27,29.53 v89.53,28.26
  Bottom 0.305: v89.53,28.26 93.34,28.26 93.98,27.62 93.98,10.79 93.34,10.16 JP2.8 89.27,8.52 90.17,7.62 v90.17,2.54
A0-VOLT
  Top 0.305: R59.2 R58.1 74.61,62.55 75.55,63.49 OLIMEXINO-STM1.A0
D7
  Top 0.305: OLIMEXINO-STM1.D7
GND  (via drill 0.5, 0.6)
  Top 0.406: C21.- 15.88,29.84 15.24,29.21 14.92,29.21 14.61,28.89
  Bottom 0.254: 51.12,18.1 51.12,14.61
  Bottom 0.305: 5.08,27.94 5.08,28.57 DC1.2 8.89,28.57 | 33.66,26.04 EXT2.3 33.66,20.32 | 97.03,37.47 SV1.6 95.57,35.88 | 67.94,66.36 67.94,64.77 | 67.94,64.77 67.94,62.87 | 65.41,66.36 65.41,64.77 | 65.41,64.77 65.41,62.87 | 20.95,70.8 EXT1.1 24.45,70.8 | 65.41,64.77 67.94,64.77
  other vias: 60.96,55.24 32.38,50.8 53.66,49.21 38.42,31.11 30.48,22.86 30.16,43.18 42.55,55.24 52.07,26.67 38.42,28.57 32.07,33.66 30.16,37.78 51.12,35.56 62.87,26.04 1.59,13.34 98.42,8.26
  pour Top (isolate 0.356, rank 6): 101.6,81.28 0,81.28 0,0 101.6,0
  pour Bottom (isolate 0.356): -0.64,-0.64 -0.64,81.92 102.23,81.92 102.23,-0.64
  pour Top (no thermals): 25.4,44.13 27.94,44.13 27.94,37.15 25.4,37.15
GND_CHASSIS  (via drill 0.5)  (1 unrouted)
  Top 0.305: 3.17,5.08 v3.17,5.71 3.17,9.53
GND_FLA1  (via drill 0.5)
  Top 0.305: v33.34,69.22 32.7,69.22 31.11,67.63 R2.2
  Top 0.813: JP6.3 R101.1
  Bottom 0.305: v33.34,69.22 45.7,69.22 46.34,69.85 JP6.3
GND_FLA2
  Top 0.305: R103.1 85.59,66.17 86.36,65.41 86.36,60.96 86.04,60.64 R4.2
  Top 0.813: JP5.3 69.83,69.86 71.75,67.94 83.5,67.94 84.14,67.31 R103.1
GND_IR
  Top 0.305: R8.2 9.84,15.88 10.48,15.24 13.03,15.24 | 13.03,15.42 13.34,15.73 R107.1
  Top 0.813: JP1.2 13.03,15.24 13.03,15.42
  Bottom 0.813: 13.03,10.79 JP1.2 13.03,11.75 13.98,12.7 26.04,12.7 27.02,11.71 JP1.6
GND_KPAD  (via drill 0.5)
  Top 0.305: R106.1 40.13,15.11 v40.01,15.24 | R7.2 v7.62,15.56
  Top 0.813: JP3.2 44.14,11.11 42.55,12.7 R106.1
  Bottom 0.305: v40.01,15.24 7.94,15.24 v7.62,15.56
GND_LCK1  (via drill 0.5)
  Top 0.305: v36.83,4.45 10.16,4.45 6.99,7.62 6.99,12.7 5.71,13.97 3.81,13.97 3.17,14.61 R6.2
  Top 0.813: JP2.2 68.27,7.93 69.22,6.99 93.34,6.99 94.48,8.12 R105.1
  Bottom 0.305: 68.25,7.93 68.27,7.93 68.27,7.95 | JP2.2 68.27,7.95 | 68.27,7.95 63.5,3.17 38.1,3.17 v36.83,4.45
GND_LCK2  (via drill 0.5)
  Top 0.305: R5.2 v5.4,15.56 | v80.64,3.17 80.33,3.49 41.59,3.49 v37.47,7.62
  Top 0.813: JP2.6 82.27,11.79 83.5,13.02 91.12,13.02 93.34,15.24 R104.1
  Bottom 0.305: v37.47,7.62 37.47,12.7 35.56,14.61 6.03,14.61 5.4,15.24 v5.4,15.56 | JP2.6 82.27,4.8 v80.64,3.17
GND_SIR1  (via drill 0.5)
  Top 0.305: v29.84,69.22 29.53,69.22 27.94,67.63 R1.2
  Top 0.813: JP6.5 39.34,66.17 R100.1
  Bottom 0.305: v29.84,69.22 33.97,73.34 38.42,73.34 39.37,72.39 39.37,71.15 JP6.5
GND_SIR2
  Top 0.305: R102.1 89.03,66.17 88.27,65.41 88.27,60.96 88.58,60.64 R3.2
  Top 0.813: JP5.5 62.84,72.36 64.14,73.66 78.74,73.66 80.64,71.75 80.64,69.85 81.28,69.22 88.58,69.22 90.49,67.31 R102.1
IR1-SENS+  (via drill 0.6)
  Top 0.305: L6.1 17.14,13.97 16.52,13.35 JP1.3 16.51,10.14
  Bottom 0.305: v17.46,2.22 17.46,7.62 16.51,8.57 16.51,10.14 JP1.3
IR1-SENS-  (via drill 0.6)
  Top 0.305: R47.2 20.32,13.34 20.02,13.04 JP1.4 20,10.14
  Bottom 0.305: v20.95,2.22 20.95,7.62 20,8.57 20,10.14 JP1.4
IR2-SENS+  (via drill 0.6)
  Top 0.305: L7.1 29.52,13.65 30.48,12.7 30.48,10.21 JP1.7 30.48,10.16
  Bottom 0.305: v31.43,2.22 31.43,7.62 30.48,8.57 30.48,10.12 JP1.7
IR2-SENS-  (via drill 0.6)
  Top 0.305: R48.2 32.7,13.02 34.02,11.7 JP1.8 33.97,10.11
  Bottom 0.305: v34.92,2.22 34.92,7.62 33.97,8.57 33.97,10.11 JP1.8
N$2
  Top 1.27: F1.2 4.45,41.89 D7.A
N$3
  Top 0.305: L1.2 C1.1 57.78,37.47 IC1.39
N$4  (via drill 0.5)
  Top 0.305: v86.04,28.26 R53.2 | SJ2.1 v96.2,57.78
  Bottom 0.305: v96.2,57.78 97.47,57.78 98.42,56.83 98.42,34.29 96.2,32.07 89.85,32.07 v86.04,28.26
N$5  (via drill 0.5)
  other vias: 5.71,3.17
N$6  (via drill 0.5)
  other vias: 3.17,0.64
N$7  (via drill 0.5)
  other vias: 0.64,3.17
N$8
  Top 0.305: 73.02,16.37 OLIMEXINO-STM1.D6
N$9
  Top 0.305: R18.2 28.89,75.25 29.84,76.2 LED1.A
N$10  (via drill 0.5)
  Top 0.305: 66.67,54.61 R20.1 R24.2 66.04,52.07 65.41,51.44 65.41,40.32 66.36,39.37 67.94,39.37 v68.9,38.42 | v68.9,33.66 68.58,33.34 68.58,27.94 L3.2
  Bottom 0.305: v68.9,38.42 v68.9,33.66
N$14  (via drill 0.5)
  Top 0.305: R19.1 85.72,53.34 | 85.72,53.34 R23.2 | L2.2 v98.11,66.04 | v84.14,53.19 85.57,53.19 85.72,53.34
  Bottom 0.305: v84.14,53.19 88.75,53.19 92.71,57.15 92.71,62.23 96.52,66.04 v98.11,66.04
N$15
  Top 0.305: R27.2 R23.1 87.52,50.17 D1.C 87.95,50.59 C10.1
N$16
  Top 0.305: R28.2 R24.1 68.47,50.17 D2.C 68.9,50.59 C11.1
N$17  (via drill 0.5)
  Top 0.305: 76.2,54.61 R21.1 R25.2 75.89,51.75 74.93,51.75 74.61,51.44 v74.61,46.04 | v81.6,34.29 81.28,33.97 81.28,27.94 82.87,26.35 L4.2
  Bottom 0.305: v81.6,34.29 81.92,34.29 83.5,35.88 83.5,44.13 81.92,45.72 74.93,45.72 v74.61,46.04
N$18
  Top 1.27: F1.1 4.45,71.12 6.99,73.66 X1.A1
N$19
  Top 0.305: R29.2 R25.1 78,50.17 D3.C 78.42,50.59 C12.1
N$20  (via drill 0.5)
  Top 0.305: v87.63,27.62 87.31,27.3 85.72,27.3 83.82,29.21 R52.2 | SJ1.1 v98.74,57.78
  Bottom 0.305: v98.74,57.78 99.06,57.47 99.06,33.97 96.52,31.43 90.49,31.43 87.63,28.57 v87.63,27.62
N$23  (via drill 0.5)
  Top 0.305: R38.1 46.04,53.11 | L6.2 v17.14,19.37 | 46.04,53.11 44.66,53.11 v44.58,53.02 | R41.2 46.04,53.11
  Bottom 0.305: v17.14,19.37 16.51,18.73 7.3,18.73 4.45,21.59 4.45,22.23 5.08,22.86 8.26,22.86 13.34,27.94 29.53,27.94 35.88,34.29 35.88,51.12 37.78,53.02 v44.58,53.02
N$25  (via drill 0.5)
  Top 0.305: v92.08,4.45 91.44,5.08 60.96,5.08 58.14,7.9 JP3.6
  Bottom 0.305: v92.08,4.45 95.25,7.62 95.25,29.21 99.69,33.66 99.69,66.67 97.79,68.58 88.27,68.58 86.98,69.86 JP4.3
N$27  (via drill 0.5)
  Top 0.305: JP6.2 49.84,72.06 51.44,73.66 v60.96,73.66
  Bottom 0.305: v60.96,73.66 75.56,73.66 76.83,72.39 JP5.1
N$28  (via drill 0.5)
  Top 0.305: R37.1 55.56,53.02 | 55.56,53.02 R40.2 | v67.94,37.47 67.94,38.42 67.63,38.73 66.04,38.73 64.77,40.01 64.77,52.73 v65.23,53.19 | v67.63,33.66 67.94,33.34 67.94,30.16 L5.2 | 55.56,53.02 54.23,53.02 v53.91,53.34
  Bottom 0.305: v67.94,37.47 67.94,33.97 v67.63,33.66 | v65.23,53.19 65.08,53.34 v53.91,53.34
N$29
  Bottom 0.305: JP5.2 73.33,69.54 73.66,69.22 82.87,69.22 83.48,69.83 JP4.4
N$30
  Top 0.305: 57.78,50.37 D4.C | R43.2 R40.1 57.36,50.17 D4.C | C15.1 57.78,50.59 D4.C
N$31
  Top 0.305: R44.2 R41.1 47.83,50.17 D5.C 48.26,50.59 C16.1
N$33
  Top 0.305: IC4.2 78.74,40.95 C7.1
N$34
  Top 0.305: IC4.6 73.66,40.01 72.39,41.27 C8.2
N$35  (via drill 0.5)
  Top 0.305: L7.2 27.3,15.88 v25.4,17.78 | 36.52,54.61 R39.1 | R39.1 R42.2 | v34.29,54.93 34.92,54.29 R39.1
  Bottom 0.305: v25.4,17.78 25.08,18.1 6.99,18.1 3.81,21.27 3.81,22.54 4.76,23.5 7.94,23.5 13.02,28.57 29.21,28.57 35.24,34.61 35.24,53.66 34.29,54.61 v34.29,54.93
N$36
  Top 0.305: R45.2 R42.1 38.62,50.17 D6.C 39.05,50.59 C17.1
N$37
  Top 0.305: IC4.1 80.78,38.56 81.28,39.05 82.23,39.05 C6.2
N$38
  Top 0.305: IC4.5 74.93,40.96 C9.2
N$44
  Top 0.305: IC4.4 76.2,40.96 C9.1
N$45
  Top 0.305: 77.47,38.73 IC4.3 77.47,37.15 77.66,36.96 81.09,36.96 81.6,37.47 C6.1
PA0  (via drill 0.5)
  Top 0.305: IC1.40 55.47,36.42 54.61,35.56 v54.61,34.61 | v29.53,64.14 28.26,64.14 R1.1
  Bottom 0.305: v54.61,34.61 53.34,34.61 52.7,35.24 52.7,39.69 55.24,42.23 55.24,44.13 54.29,45.09 52.07,45.09 50.48,46.67 50.48,57.15 49.21,58.42 38.42,58.42 34.29,62.55 31.11,62.55 v29.53,64.14
PA1  (via drill 0.5)
  Top 0.305: IC1.41 55.04,36.94 v53.66,35.56 | R2.1 32.7,64.45 v33.02,64.14
  Bottom 0.305: v53.66,35.56 53.34,35.88 53.34,39.37 55.88,41.91 55.88,44.45 54.61,45.72 52.39,45.72 51.12,46.99 51.12,57.47 49.53,59.05 38.73,59.05 34.61,63.18 33.97,63.18 v33.02,64.14
PA2  (via drill 0.5)
  Top 0.305: IC1.42 54.47,37.65 55.56,38.73 v56.83,38.73 | v90.81,58.74 91.44,59.37 R3.1
  Bottom 0.305: v90.81,58.74 90.81,58.42 87.63,55.24 75.56,55.24 59.37,39.05 57.15,39.05 v56.83,38.73
PA3  (via drill 0.5)
  Top 0.305: IC1.43 53.99,38.11 55.56,39.69 v55.88,39.69 | v83.19,58.74 R4.1
  Bottom 0.305: v83.19,58.74 83.19,58.42 80.64,55.88 75.25,55.88 59.05,39.69 v55.88,39.69
PA4  (via drill 0.5)
  Top 0.305: R5.1 5.4,20 v6.67,21.27 | IC1.44 53.34,38.74 53.66,39.05 53.34,39.37 53.34,41.02 v52.58,41.78
  Bottom 0.305: v6.67,21.27 8.57,21.27 13.97,26.67 30.16,26.67 46.35,42.86 51.5,42.86 v52.58,41.78
PA5  (via drill 0.5)
  Top 0.305: v53.34,43.5 52.07,43.5 50.8,42.23 50.8,39.37 50.48,39.05 50.48,38.99 IC1.1 | v5.54,21.92 5.54,21.09 4.13,19.68 R6.1
  Bottom 0.305: v53.34,43.5 46.04,43.5 29.84,27.3 13.65,27.3 8.57,22.23 5.84,22.23 v5.54,21.92
PA6  (via drill 0.5)
  Top 0.305: R7.1 v7.62,20.32 | v49.85,41.91 50.16,41.59 50.16,40.32 49.53,39.69 49.53,38.81 IC1.2
  Bottom 0.305: v7.62,20.32 8.57,20.32 14.29,26.04 30.48,26.04 46.67,42.23 49.53,42.23 v49.85,41.91
PA7  (via drill 0.5)
  Top 0.305: R8.1 v9.84,20.32 | 49.76,37.55 IC1.3 48.9,38.32 48.9,40.32 v49.21,40.64
  Bottom 0.305: v49.21,40.64 49.21,41.27 48.9,41.59 46.99,41.59 30.8,25.4 14.61,25.4 9.84,20.64 v9.84,20.32
PB0-VOLT  (via drill 0.5)
  Top 0.305: IC1.4 49.06,36.98 48.26,37.78 48.26,41.91 51.44,45.09 54.29,45.09 54.75,44.63 v56.77,44.63 | R22.1 R30.2 54.93,61.28 54.29,60.64 v54.29,60.01
  Bottom 0.305: v54.29,60.01 51.75,57.47 51.75,47.31 52.7,46.35 54.93,46.35 56.66,44.63 v56.77,44.63
PB1-TAMP
  Top 0.305: IC1.5 47.62,37.33 47.62,42.23 51.12,45.72 55.24,45.72 55.46,45.94 55.46,46.14 R43.1 R49.1
PB2-IR1
  Top 0.305: IC1.6 | IC1.6 46.99,36.83 46.99,44.13 46.04,45.09 R44.1 R50.1
PB3-IR2
  Top 0.305: IC1.7 47.26,35.29 46.35,36.2 46.35,42.23 42.86,45.72 39.37,45.72 R51.1 R45.1
PC0-TWISDA  (via drill 0.5)
  Top 0.305: OLIMEXINO-STM1.D9 63.65,16.36 62.87,17.14 53.66,17.14 v47.94,22.86 | SV1.4 95.57,39.69 94.61,38.73 90.81,38.73 85.27,33.2 v84.71,33.2 83.82,32.31 R52.1 | v48.26,29.9 48.26,31.43 47.62,32.07 47.23,32.07 IC1.10
  Bottom 0.305: v47.94,22.86 47.94,29.58 v48.26,29.9 48.53,30.16 49.85,30.16 52.7,27.3 60.96,27.3 65.09,31.43 81.92,31.43 83.68,33.2 v84.71,33.2
PC1-TWISCL  (via drill 0.5)
  Top 0.305: IC1.11 45.14,32.97 v47.31,30.8 | SV1.3 91.12,40.01 85.46,34.34 v85.09,34.34 | v46.67,22.86 47.62,21.91 47.94,21.91 53.34,16.51 60.96,16.51 62.87,14.61 73.8,14.61 OLIMEXINO-STM1.D5 | v86.94,33.34 86.94,32.65 R53.1
  Bottom 0.305: v46.67,22.86 47.31,23.5 v47.31,30.8 50.16,30.8 53.02,27.94 60.64,27.94 64.77,32.07 81.6,32.07 83.87,34.34 v85.09,34.34 86.09,33.34 v86.94,33.34
PC2-EXT  (via drill 0.5)
  Top 0.305: IC1.12 45.08,30.48 44.77,30.16 44.13,30.16 36.51,37.78 33.97,37.78 v33.66,38.1 | 28.57,70.49 R18.1 28.89,69.85 28.26,69.22 v27.94,69.22 | v22.23,63.18 R17.1 22.86,64.45 23.5,65.09 23.5,67.63 23.81,67.94 v24.45,67.94
  Bottom 0.305: v33.66,38.1 33.66,38.42 34.61,39.37 34.61,53.02 24.45,63.18 v22.23,63.18 | 27.62,69.22 v27.94,69.22 26.67,69.22 25.4,67.94 v24.45,67.94
PC2-EXT-RX
  Top 0.305: EXT1.2 24.13,73.34 24.77,72.71 24.77,69.85 22.23,67.31 R17.2
PC3
  Top 0.305: IC3.3 31.75,47.62 32.7,46.67 32.7,42.86 32.07,42.23 R13.1
PC3-FLA2-TX
  Top 0.305: R57.1 25.4,74.93 24.45,75.88 EXT1.3
PC3-PWR-FLA2  (via drill 0.5)
  Top 0.305: 32.07,38.42 R13.2 v32.07,38.1 33.02,37.15 36.2,37.15 44.13,29.21 45.01,29.21 IC1.13 | R57.2 25.4,63.5 v24.13,62.23
  Bottom 0.305: v32.07,38.1 32.38,38.1 33.97,39.69 33.97,52.7 24.45,62.23 v24.13,62.23
PC4
  Top 0.305: IC2.9 R12.1
PC4-PWR-LCK2
  Top 0.305: R12.2 37.47,34.92 43.81,28.57 45.5,28.57 IC1.14
PC5
  Top 0.305: IC2.7 R11.1
PC5-PWR-LCK1
  Top 0.305: IC1.15 46,27.94 43.5,27.94 39.05,32.38 R11.2
PC6
  Top 0.305: IC2.5 R10.1
PC6-PWR-KPAD
  Top 0.305: R10.2 40.64,29.84 43.18,27.3 46.49,27.3 IC1.16
PC7
  Top 0.305: IC2.3 R9.1
PC7-PWR-IR
  Top 0.305: R9.2 42.23,27.3 42.86,26.67 46.99,26.67 IC1.17
PD0
  Top 0.305: S1.16 91.44,19.05 90.17,17.78 53.98,17.78 48.9,22.86 48.9,25.18 IC1.20
PD1
  Top 0.305: S1.15 91.44,20.32 89.53,18.41 54.29,18.41 49.53,23.18 49.53,24.68 IC1.21
PD2-RXD  (via drill 0.5)
  Top 0.305: S1.14 91.44,21.59 88.9,19.05 54.61,19.05 51.12,22.54 | IC1.22 50.16,24.19 50.16,23.5 51.12,22.54 | v51.44,22.86 51.12,22.54
  Bottom 0.305: v51.44,22.86 51.44,22.54 49.85,20.95 42.23,20.95 39.69,23.5 EXT2.1
PD3-TXD  (via drill 0.5)
  Top 0.305: S1.13 91.44,22.86 88.27,19.68 58.48,19.68 54.96,23.21 | 54.96,23.21 IC1.23 | v54.61,22.86 54.96,23.21
  Bottom 0.305: v54.61,22.86 52.7,22.86 50.16,20.32 41.91,20.32 40.32,21.91 36.83,21.91 36.2,22.54 EXT2.2
PD4
  Top 0.305: S1.12 91.44,24.13 87.63,20.32 58.98,20.32 IC1.24
PD5
  Top 0.305: S1.11 91.44,25.4 87,20.95 59.47,20.95 IC1.25
PD6
  Top 0.305: S1.10 91.44,26.67 86.36,21.59 59.97,21.59 IC1.26
PD7
  Top 0.305: S1.9 91.44,27.94 85.72,22.23 60.46,22.23 IC1.27
PDI_CLK  (via drill 0.5)
  Top 0.305: v93.98,52.7 R55.1 | IC1.35 58.43,33.67 v60.01,35.24
  Bottom 0.305: v93.98,52.7 92.39,51.12 77.47,51.12 61.59,35.24 v60.01,35.24
PDI_CLK/EXT  (via drill 0.5)
  Top 0.305: R54.1 R55.2 98.74,52.7 99.38,52.07 99.38,36.2 98.11,34.92 v96.52,34.92
  Bottom 0.305: v96.52,34.92 96.2,34.61 94.3,34.61 93.03,35.88 SV1.5
PDI_DATA  (via drill 0.5)
  Top 0.305: v93.98,50.48 R56.1 | IC1.34 59.06,33.02 60.33,34.29 v60.96,34.29
  Bottom 0.305: v93.98,50.48 77.79,50.48 61.59,34.29 v60.96,34.29
PDI_DATA/EXT
  Top 0.305: SV1.1 93.03,42.23 93.98,41.27 97.16,41.27 97.69,41.81 97.69,50.38 R56.2
PE0
  Top 0.305: IC3.9 31.43,55.24 31.75,54.93 31.75,53.98 34.61,51.12 34.61,43.81 34.92,43.5 37.78,43.5 38.73,42.55 R16.1
PE0-PWR-SIR1  (via drill 0.5)
  Top 0.305: R16.2 38.73,38.42 42.86,34.29 v43.18,34.29 | v53.98,31.11 53.98,29.84 IC1.28
  Bottom 0.305: v53.98,31.11 51.12,33.97 43.5,33.97 v43.18,34.29
PE1
  Top 0.305: IC3.7 32.07,52.7 33.97,50.8 33.97,43.18 34.29,42.86 35.88,42.86 36.51,42.23 R15.1
PE1-PWR-FLA1  (via drill 0.5)
  Top 0.305: v43.5,33.02 43.18,33.02 R15.2 | IC1.29 54.93,30.02 v54.93,30.16
  Bottom 0.305: v43.5,33.02 43.81,33.34 50.48,33.34 53.66,30.16 v54.93,30.16
PE2
  Top 0.305: IC3.5 31.11,50.16 31.75,49.53 31.75,48.58 33.34,46.99 33.34,42.86 34.29,41.91 R14.1
PE2-PWR-SIR2  (via drill 0.5)
  Top 0.305: R14.2 34.29,38.73 34.61,38.42 36.83,38.42 43.5,31.75 v44.45,31.75 | IC1.32 57.15,31.2 v57.15,31.43
  Bottom 0.305: v57.15,31.43 57.15,30.8 55.56,29.21 53.66,29.21 50.16,32.7 45.4,32.7 v44.45,31.75
PE3-BALC  (via drill 0.5)
  Top 0.305: IC1.33 59.69,30.48 60.64,31.43 v60.64,32.07 | R34.1 R27.1 82.87,46.04 v81.6,44.77
  Bottom 0.305: v60.64,32.07 60.64,32.38 73.34,45.09 81.28,45.09 v81.6,44.77
PR0-DOOR1  (via drill 0.5)
  Top 0.305: IC1.36 58.74,35.02 58.74,35.56 v58.1,36.2 | v66.67,44.7 R28.1 R35.1
  Bottom 0.305: v58.1,36.2 58.1,36.83 65.98,44.7 v66.67,44.7
PR1-DOOR2  (via drill 0.5)
  Top 0.305: IC1.37 56.2,33.62 v56.2,33.34 | R36.1 R29.1 76.2,45.09 74.61,43.5 v68.58,43.5
  Bottom 0.305: v56.2,33.34 56.52,33.34 59.37,36.2 61.59,36.2 68.58,43.18 v68.58,43.5
PWR_FLA1
  Top 0.406: IC3.14 22.23,52.7
  Top 0.813: JP6.4 42.84,63.16 41.27,61.59 27.94,61.59 24.13,57.78 24.13,53.98 22.86,52.7 22.23,52.7
PWR_FLA2
  Top 0.406: IC3.18 22.23,47.62
  Top 0.813: 66.33,70.78 JP5.4 66.33,69.83 64.45,67.94 52.07,67.94 50.8,66.67 50.8,61.59 48.26,59.05 29.21,59.05 26.67,56.52 26.67,49.53 24.77,47.62 22.23,47.62
PWR_IR
  Top 0.406: IC2.18 22.23,27.3
  Top 0.813: 22.23,27.3 22.86,26.67 22.86,13.02 23.5,12.38 23.5,10.19 JP1.5 23.52,8.29 22.23,6.99 10.79,6.99 9.53,8.26 JP1.1
PWR_KPAD
  Top 0.406: IC2.17 22.23,28.57
  Top 0.813: JP3.1 39.37,10.16 38.1,11.43 38.1,16.51 36.2,18.41 27.3,18.41 24.13,21.59 24.13,26.99 22.54,28.57 22.23,28.57
PWR_LCK1
  Top 0.406: IC2.14 22.23,32.38
  Top 0.813: 22.23,32.38 24.13,32.38 25.4,31.11 25.4,22.23 27.94,19.68 44.13,19.68 45.4,18.41 45.4,13.97 46.67,12.7 59.05,12.7 61.59,10.16 JP2.1
PWR_LCK2
  Top 0.406: IC2.13 22.23,33.66
  Top 0.813: 22.23,33.66 24.77,33.66 26.67,31.75 26.67,22.86 28.57,20.95 44.77,20.95 46.67,19.05 46.67,14.61 47.31,13.97 60.33,13.97 61.28,13.02 77.79,13.02 78.77,12.04 JP2.5
PWR_SIR1
  Top 0.406: IC3.13 22.23,53.98
  Top 0.813: JP6.6 35.84,70.77 35.88,70.73 35.88,63.82 34.92,62.87 27.3,62.87 22.86,58.42 22.86,54.61 22.23,53.98
PWR_SIR2
  Top 0.406: IC3.17 22.23,48.9
  Top 0.813: 22.23,48.9 24.13,48.9 25.4,50.16 25.4,57.15 28.57,60.33 47.62,60.33 49.53,62.23 49.53,67.31 51.44,69.22 58.74,69.22 59.34,69.81 JP5.6
RXD  (via drill 0.5)
  Top 0.305: IC4.12 v74.93,26.67
  Bottom 0.305: OLIMEXINO-STM1.D0 84.77,19.84 84.77,26.67 82.23,29.21 73.98,29.21 72.71,27.94 72.71,26.35 73.34,25.72 74.61,25.72 74.93,26.04 v74.93,26.67
RXD-OUT  (via drill 0.5)
  Top 0.305: IC4.13 v76.2,26.67
  Bottom 0.305: JP3.4 51.14,11.77 51.75,12.38 53.66,12.38 64.45,23.18 64.45,24.77 64.77,25.08 69.53,25.08 70.8,23.81 74.61,23.81 76.2,25.4 v76.2,26.67
TAMP+  (via drill 0.5, 0.6)
  Top 0.305: v65.41,24.13 L5.1
  Bottom 0.305: v65.41,24.13 65.41,23.18 54.64,12.41 JP3.5 54.64,8.54 55.56,7.62 v55.56,5.08
TAMP-  (via drill 0.5, 0.6)
  Top 0.305: v31.11,74.61 R46.2 | v50.16,74.3 50.16,76.2 v53.34,79.38
  Bottom 0.305: v31.11,74.61 31.43,74.93 49.53,74.93 v50.16,74.3 51.44,74.3 53.34,72.39 JP6.1
TXD  (via drill 0.5)
  Top 0.305: IC4.11 v73.66,26.67
  Bottom 0.305: v73.66,26.67 73.34,26.99 73.34,27.62 74.3,28.57 81.92,28.57 84.14,26.35 84.14,19.37 85.72,17.78 85.72,16.37 OLIMEXINO-STM1.D1
TXD-OUT  (via drill 0.5)
  Top 0.305: IC4.14 77.47,26.04 77.15,25.72 72.07,25.72 v71.44,25.08
  Bottom 0.305: JP3.3 47.64,11.76 48.9,13.02 53.34,13.02 63.82,23.5 63.82,25.08 64.45,25.72 70.8,25.72 v71.44,25.08
VCC  (via drill 0.5, 0.6)
  Top 0.305: R54.2 v93.98,54.93 | IC1.9 46.17,34.15 44.45,35.88 C4.1 | 49.1,26.56 IC1.19 47.3,24.72 C3.1 | 87.35,37.51 86.84,36.99 | C5.2 IC4.16 | C22.+ 65.41,35.56 | v97.47,64.14 97.47,62.55 | 97.47,62.55 96.84,62.55 96.2,61.91 SJ2.2 | 97.47,62.55 98.11,62.55 98.74,61.91 SJ1.2
  Top 0.406: L1.1 62.87,39.69 | IC4.16 80.01,35.56 | 49.1,26.56 51.12,28.57 51.12,29.84 50.64,30.32 | 50.64,30.32 47.94,33.02 47.41,33.02 IC1.9 | 50.64,30.32 53.34,33.02 54.19,33.02 IC1.31 59.59,27.62 C2.1
  Top 0.61: 62.87,35.56 62.87,39.69 v62.87,46.35 62.87,64.61 OLIMEXINO-STM1.3V3A | 62.87,35.56 62.87,28.57 61.91,27.62 C2.1 | 62.87,35.56 65.41,35.56 80.01,35.56 85.41,35.56 86.84,36.99 91.44,41.59 91.44,43.11 92.46,44.13 94.93,44.13 95.57,43.5 SV1.2
  Bottom 0.305: SV1.2 95.57,54.29 94.93,54.93 v93.98,54.93 93.98,60.64 v97.47,64.14
(copper drawn outside any net)
  shapes: Bottom circle x1, Top circle x1

### Text on the board
Top: IO-R4-L1
Bottom: IO-R4-L2
tPlace: STAT | 12V | TX | PC3 | SIR1 | FLA1 | TMP | SIR2 | FLA2 | TMP | TMP | BALC | MAX 30V | RX | PC2 | GND | VIN | SV2 | A0 | SV7 | VCC | GND | GND | VIN | VCC | I2C-UP | 24V | VCC | IR2 | IR1 | TAMP | DOOR1 | DOOR2 | BALC | 12V | 12V | GND | ON | OFF | 2 | 24V | 1 | 32 | 16 | GND | TX | RX | 8 | 4 | 2 | 1 | GND | D9 | D8 | D7 | D6 | D5 | D1 | D0 | SV4 | SV5 | SV3 | SV6 | IR1 | SE1 | IR1 | SE2 | KPAD | TXD | RXD | TMP | LK1 | DS1 | LK2 | DS2
tGlue: + | - | 24V | SIR1 | SIR2 | TMP | TMP | BALC | + | - | + | FLA1 | - | TMP | + | - | + | FLA2 | - | I2C | KB20 | + | - | + | - | + | - | + | - | IR2 | SE2 | KEY | TXD | RXD | TMP | LK1 | DS1 | LK2 | DS2
tRestrict: MkIV